# Altium project BASC.PrjPcb
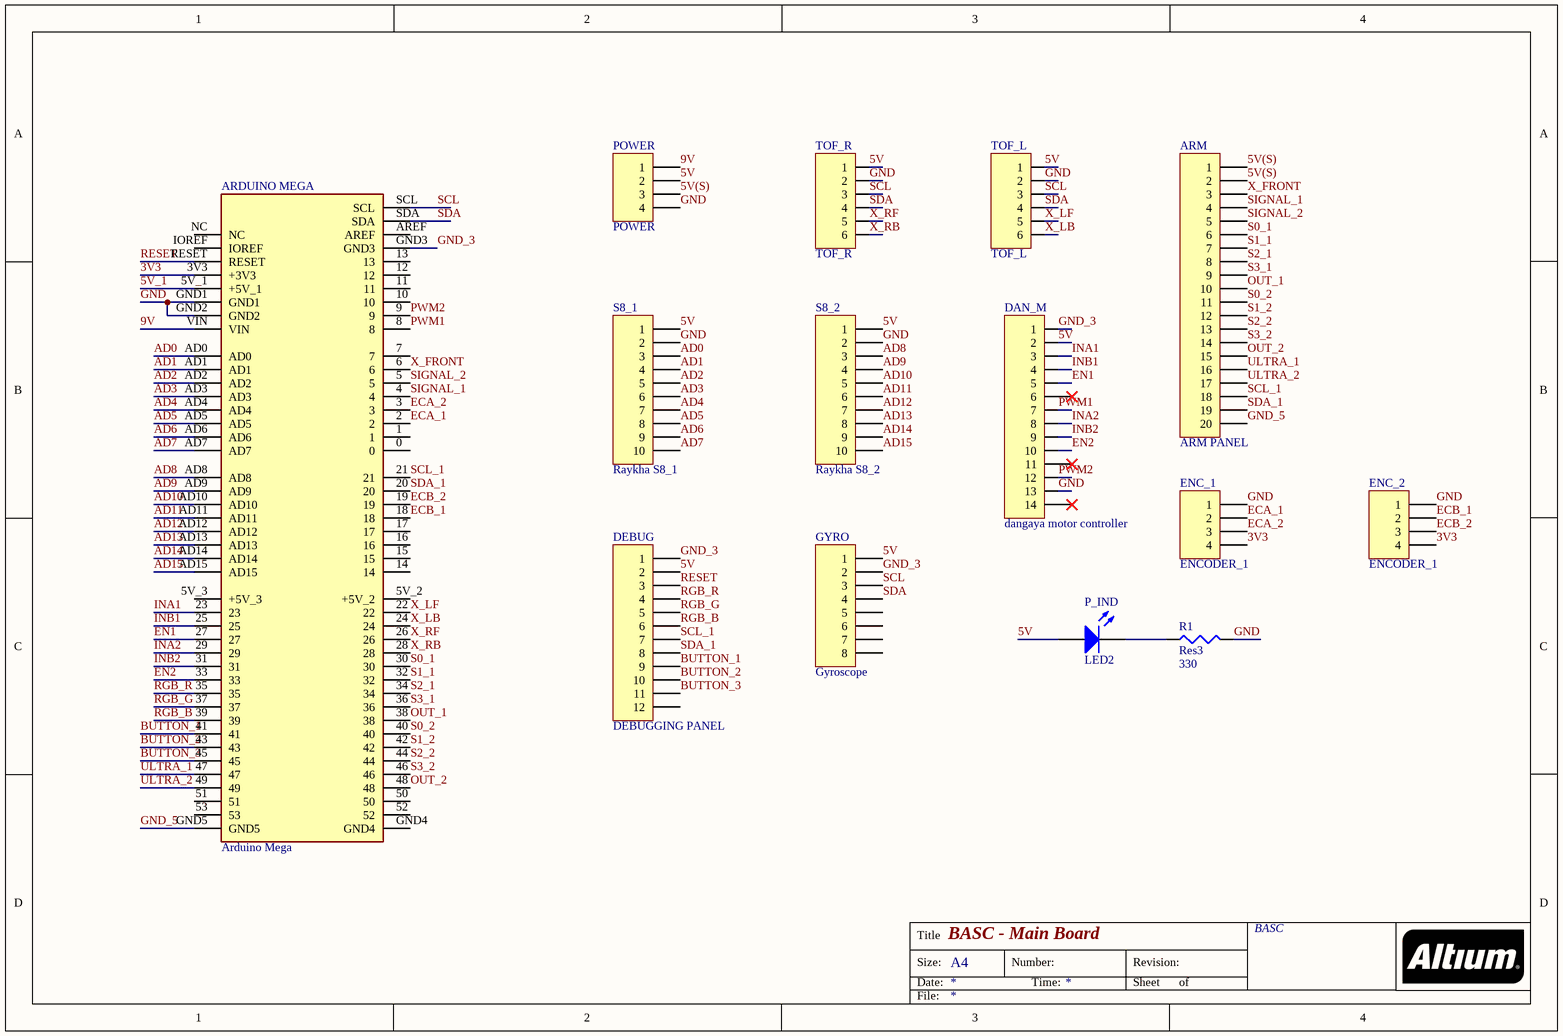
[diagram p0: main_board_schem.SchDoc]
1 sheet, 14 parts. Net scope: global (net labels, ports and power ports of the same name join across sheets).
Board file: mega_board_version_1.PcbDoc

## Sheet main_board_schem.SchDoc: BASC - Main Board
size A4; Organization: BASC

### Parts
ARDUINO_MEGA  Arduino Mega  [ARDUINO_A000067]
ARM  ARM PANEL  [HDR2X10]
DAN_M  dangaya motor controller  [HDR1X14]
DEBUG  DEBUGGING PANEL  [HDR1X12]
ENC_1  ENCODER_1  [HDR1X4]
ENC_2  ENCODER_1  [HDR1X4]
GYRO  Gyroscope  [HDR1X8]
P_IND  LED2  [3.2X1.6X1.1]
POWER  POWER  [HDR1X4]
R1  Res3  value 330  [RESC3216X75N]
S8_1  Raykha S8_1  [HDR1X10]
S8_2  Raykha S8_2  [HDR1X10]
TOF_L  TOF_L  [HDR1X6]
TOF_R  TOF_R  [HDR1X6]

### Nets
3V3: ARDUINO_MEGA.3V3(+3V3) ENC_1.4 ENC_2.4
5V: DAN_M.2 DEBUG.2 GYRO.1 P_IND.1(A) POWER.2 S8_1.1 S8_2.1 TOF_L.1 TOF_R.1
5V(S): ARM.1 ARM.2 POWER.3
5V_1: ARDUINO_MEGA.5V_1(+5V_1)
9V: ARDUINO_MEGA.VIN POWER.1
AD0: ARDUINO_MEGA.AD0 S8_1.3
AD1: ARDUINO_MEGA.AD1 S8_1.4
AD2: ARDUINO_MEGA.AD2 S8_1.5
AD3: ARDUINO_MEGA.AD3 S8_1.6
AD4: ARDUINO_MEGA.AD4 S8_1.7
AD5: ARDUINO_MEGA.AD5 S8_1.8
AD6: ARDUINO_MEGA.AD6 S8_1.9
AD7: ARDUINO_MEGA.AD7 S8_1.10
AD8: ARDUINO_MEGA.AD8 S8_2.3
AD9: ARDUINO_MEGA.AD9 S8_2.4
AD10: ARDUINO_MEGA.AD10 S8_2.5
AD11: ARDUINO_MEGA.AD11 S8_2.6
AD12: ARDUINO_MEGA.AD12 S8_2.7
AD13: ARDUINO_MEGA.AD13 S8_2.8
AD14: ARDUINO_MEGA.AD14 S8_2.9
AD15: ARDUINO_MEGA.AD15 S8_2.10
BUTTON_1: ARDUINO_MEGA.41 DEBUG.9
BUTTON_2: ARDUINO_MEGA.43 DEBUG.10
BUTTON_3: ARDUINO_MEGA.45 DEBUG.11
ECA_1: ARDUINO_MEGA.2 ENC_1.2
ECA_2: ARDUINO_MEGA.3 ENC_1.3
ECB_1: ARDUINO_MEGA.18 ENC_2.2
ECB_2: ARDUINO_MEGA.19 ENC_2.3
EN1: ARDUINO_MEGA.27 DAN_M.5
EN2: ARDUINO_MEGA.33 DAN_M.10
GND: ARDUINO_MEGA.GND1 ARDUINO_MEGA.GND2 DAN_M.13 ENC_1.1 ENC_2.1 POWER.4 R1.2 S8_1.2 S8_2.2 TOF_L.2 TOF_R.2
GND_3: ARDUINO_MEGA.GND3 DAN_M.1 DEBUG.1 GYRO.2
GND_5: ARDUINO_MEGA.GND5 ARM.20
INA1: ARDUINO_MEGA.23 DAN_M.3
INA2: ARDUINO_MEGA.29 DAN_M.8
INB1: ARDUINO_MEGA.25 DAN_M.4
INB2: ARDUINO_MEGA.31 DAN_M.9
OUT_1: ARDUINO_MEGA.38 ARM.10
OUT_2: ARDUINO_MEGA.48 ARM.15
PWM1: ARDUINO_MEGA.8 DAN_M.7
PWM2: ARDUINO_MEGA.9 DAN_M.12
RESET: ARDUINO_MEGA.RESET DEBUG.3
RGB_B: ARDUINO_MEGA.39 DEBUG.6
RGB_G: ARDUINO_MEGA.37 DEBUG.5
RGB_R: ARDUINO_MEGA.35 DEBUG.4
S0_1: ARDUINO_MEGA.30 ARM.6
S0_2: ARDUINO_MEGA.40 ARM.11
S1_1: ARDUINO_MEGA.32 ARM.7
S1_2: ARDUINO_MEGA.42 ARM.12
S2_1: ARDUINO_MEGA.34 ARM.8
S2_2: ARDUINO_MEGA.44 ARM.13
S3_1: ARDUINO_MEGA.36 ARM.9
S3_2: ARDUINO_MEGA.46 ARM.14
SCL: ARDUINO_MEGA.SCL GYRO.3 TOF_L.3 TOF_R.3
SCL_1: ARDUINO_MEGA.21 ARM.18 DEBUG.7
SDA: ARDUINO_MEGA.SDA GYRO.4 TOF_L.4 TOF_R.4
SDA_1: ARDUINO_MEGA.20 ARM.19 DEBUG.8
SIGNAL_1: ARDUINO_MEGA.4 ARM.4
SIGNAL_2: ARDUINO_MEGA.5 ARM.5
ULTRA_1: ARDUINO_MEGA.47 ARM.16
ULTRA_2: ARDUINO_MEGA.49 ARM.17
X_FRONT: ARDUINO_MEGA.6 ARM.3
X_LB: ARDUINO_MEGA.24 TOF_L.6
X_LF: ARDUINO_MEGA.22 TOF_L.5
X_RB: ARDUINO_MEGA.28 TOF_R.6
X_RF: ARDUINO_MEGA.26 TOF_R.5
NetP_IND_2: P_IND.2(K) R1.1

Not connected (* = marked no-connect by the designer): ARDUINO_MEGA 0 1 5V_2(+5V_2) 5V_3(+5V_3) 7 10 11 12 13 14 15 16 17 50 51 52 53 AREF GND4 IOREF NC; DAN_M 6* 11* 14*; DEBUG 12; GYRO 5 6 7 8

### Notes on the sheet
- Title
- Size:
- Date:
- A4
- Number:
- Time:
- Revision:
- Sheet
- of
- File:

### Library data of the parts
ARDUINO_MEGA = A000067: ATmega2560 Arduino Mega2560 AVRÂ® ATmega AVR MCU 8-Bit Embedded Evaluation Board; Availability: Unavailable; Package: None; SnapEDA_Link: https://www.snapeda.com/parts/A000067/Arduino/view-part/557398/?ref=snap; MP: A000067; Price: None; Value: *; MF: Arduino
ARM = Header 20: Header, 20-Pin; LatestRevisionDate: 17-Jul-2002; LatestRevisionNote: Re-released for DXP Platform.; Publisher: Altium Limited
DAN_M = Header 14: Header, 14-Pin; LatestRevisionDate: 17-Jul-2002; LatestRevisionNote: Re-released for DXP Platform.; Publisher: Altium Limited
DEBUG = Header 12: Header, 12-Pin; LatestRevisionDate: 17-Jul-2002; LatestRevisionNote: Re-released for DXP Platform.; Publisher: Altium Limited
ENC_1 ENC_2 POWER = Header 4: Header, 4-Pin; LatestRevisionDate: 17-Jul-2002; LatestRevisionNote: Re-released for DXP Platform.; Publisher: Altium Limited
GYRO = Header 8: Header, 8-Pin; LatestRevisionDate: 17-Jul-2002; LatestRevisionNote: Re-released for DXP Platform.; Publisher: Altium Limited
P_IND = LED2: Typical RED, GREEN, YELLOW, AMBER GaAs LED; Published: 8-Jun-2000; LatestRevisionDate: 17-Jul-2002; LatestRevisionNote: Re-released for DXP Platform.; PackageVersion: Feb-2002; PackageReference: 3.2X1.6X1.1; Publisher: Altium Limited; PackageDescription: SM LED; 2 Flat Leads
R1 = Res3: Resistor; Published: 8-Jun-2000; LatestRevisionDate: 29-May-2009; LatestRevisionNote: IPC-7351 Footprint Added.; PackageReference: J1-0603; Publisher: Altium Limited; PackageDescription: Chip Resistor
S8_1 S8_2 = Header 10: Header, 10-Pin; LatestRevisionDate: 17-Jul-2002; LatestRevisionNote: Re-released for DXP Platform.; Publisher: Altium Limited
TOF_L TOF_R = Header 6: Header, 6-Pin; LatestRevisionDate: 17-Jul-2002; LatestRevisionNote: Re-released for DXP Platform.; Publisher: Altium Limited